# Altium project driver_board.PrjPcb
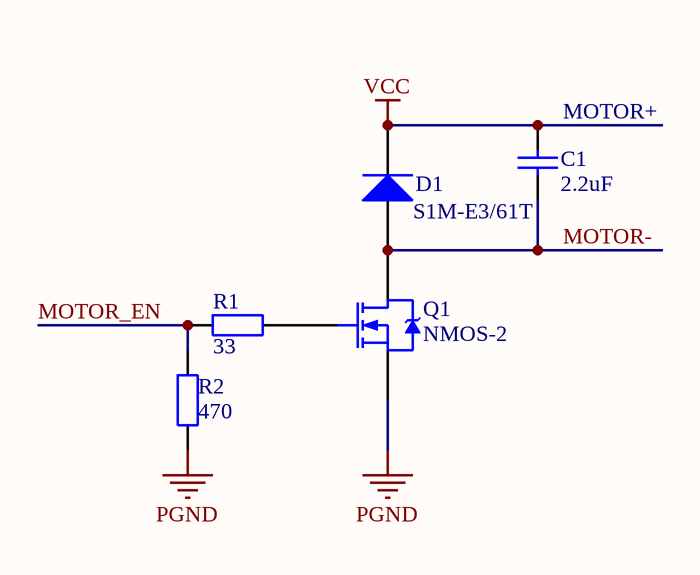
[diagram p0: Sheet1.SchDoc]
1 sheet, 5 parts. Net scope: global (net labels, ports and power ports of the same name join across sheets).
Board file: PCB1.PcbDoc

## Sheet Sheet1.SchDoc
size A4

### Parts
C1  value 2.2uF  [0805[cap]]  (hidden comment: CT41L-0805-2C1-25V-225K)
D1  S1M-E3/61T  [M7]
Q1  NMOS-2  [DPAK228P991X239-3N]
R1  value 33  [0603[res]]  (hidden comment: RMK1608MB102J)
R2  value 470  [0603[res]]  (hidden comment: RMK1608MB102J)

### Nets
PGND: Q1.3(S) R2.1
VCC: C1.2 D1.2(K)
MOTOR-: C1.1 D1.1(A) Q1.2(D)
MOTOR_EN: R1.1 R2.2
NetQ1_1: Q1.1(G) R1.2

### Notes on the sheet
- (near C1) MOTOR+

### Library data of the parts
C1 = Capacitor: Chip Capacitor
D1 = Diode 1N4007: 1 Amp General Purpose Rectifier
Q1 = NMOS-2: N-Channel Power MOSFET; Note: Pin 2 is electrically connected to pin 4.; Published: 8-Jun-2000; LatestRevisionDate: 17-Jul-2002; LatestRevisionNote: Re-released for DXP Platform.; DatasheetVersion: PD-9.814; PackageVersion: Feb-1997; PackageReference: TO-220AB; Publisher: Altium Limited; PackageDescription: TO, Thru-Hole, Vertical, Heatsink Mounted; 3 In-Line Leads; Pitch 2.54 mm; ComponentLink1Description: Manufacturer Link; ComponentLink1URL: http://www.irf.com/
R1 R2 = Resistor